# Altium schematic sheet Oscar_MainBoard_MCU.SchDoc
size A4
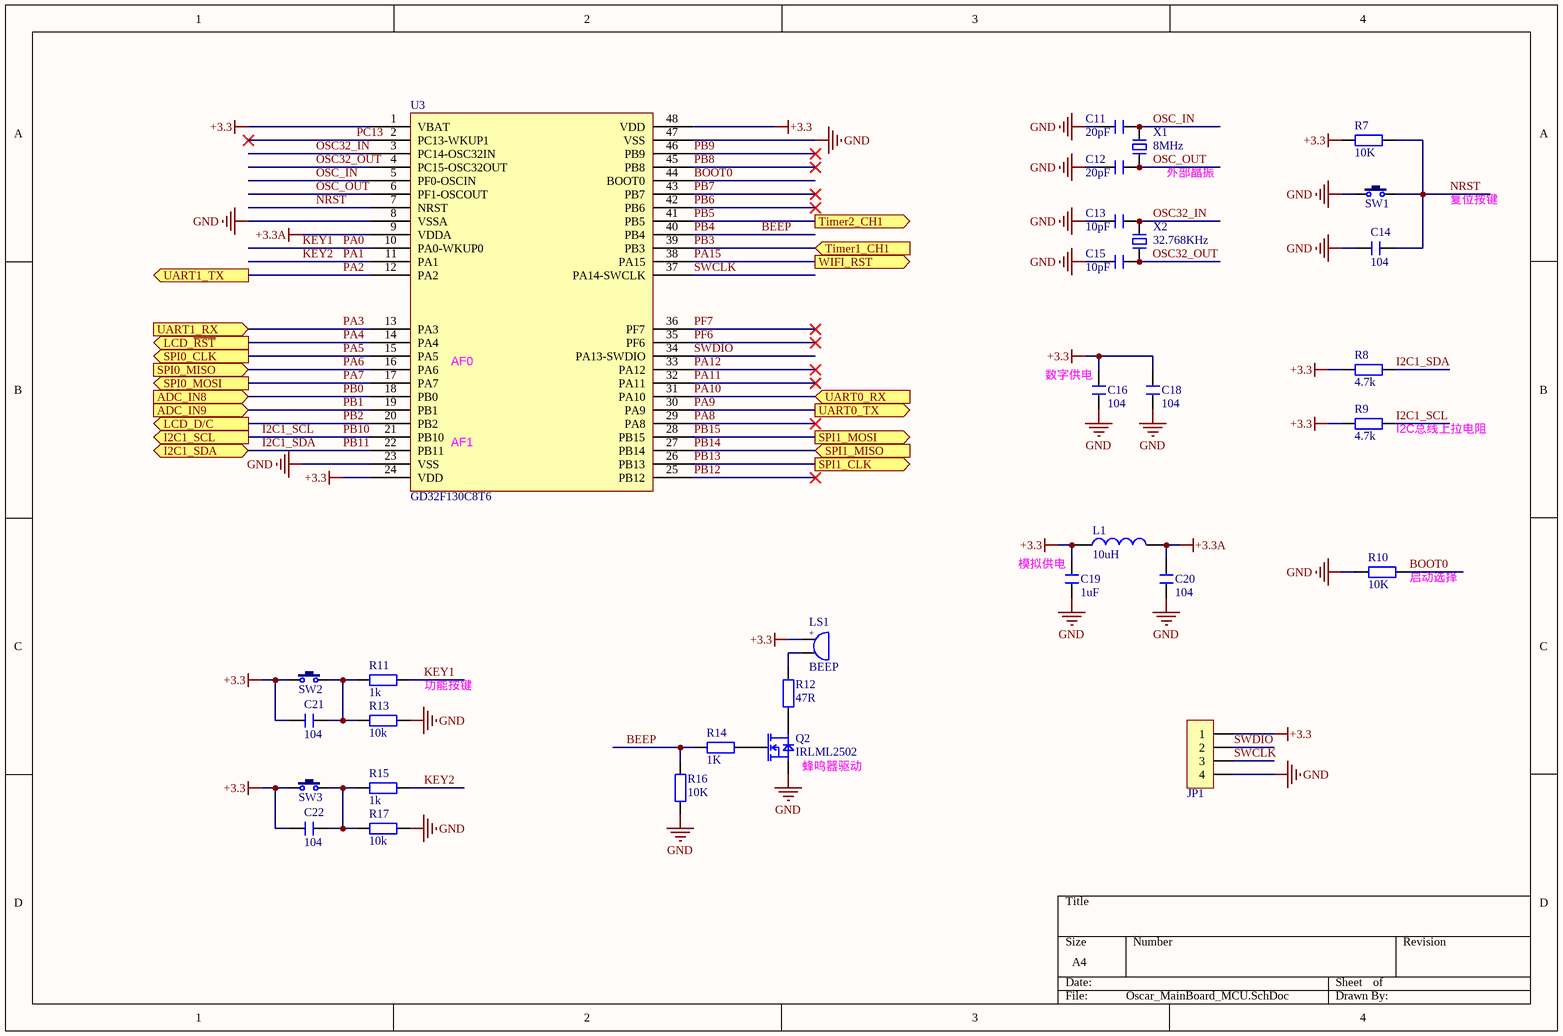
[diagram p0: Oscar_MainBoard_MCU.SchDoc]

## Parts
C11  20pF  [C 0402_L]
C12  20pF  [C 0402_L]
C13  10pF  [C 0402_L]
C14  104  [C 0402_L]
C15  10pF  [C 0402_L]
C16  104  [C 0402_L]
C18  104  [C 0402_L]
C19  1uF  [C 0402_L]
C20  104  [C 0402_L]
C21  104  [C 0402_L]
C22  104  [C 0402_L]
JP1  HDR-1X4  [HDR2.54-WS-4P]  (value not drawn)
L1  10uH  [L 0402]
LS1  BEEP  [BEEP 5020]
Q2  IRLML2502  [SOT23-3n]
R7  10K  [R 0402_L]
R8  4.7k  [R 0402_L]
R9  4.7k  [R 0402_L]
R10  10K  [R 0402_L]
R11  1k  [R 0402_L]
R12  47R  [R 0402_L]
R13  10k  [R 0402_L]
R14  1K  [R 0402_L]
R15  1k  [R 0402_L]
R16  10K  [R 0402_L]
R17  10k  [R 0402_L]
SW1  TSW  [龟仔 3*4]  (value not drawn)
SW2  TSW  [龟仔 3*4]  (value not drawn)
SW3  TSW  [龟仔 3*4]  (value not drawn)
U3  GD32F130C8T6  [LQFP48_N]
X1  8MHz  [NDK 3225]
X2  32.768KHz  [FC-135]

## Ports
ADC_IN8 (in), ADC_IN9 (in), I2C1_SCL (out), I2C1_SDA (bidir), LCD_D/C (out), LCD_~{RST} (out), SPI0_CLK (out), SPI0_MISO (in), SPI0_MOSI (out), SPI1_CLK (out), SPI1_MISO (in), SPI1_MOSI (out), Timer1_CH1 (in), Timer2_CH1 (out), UART0_RX (in), UART0_TX (out), UART1_RX (in), UART1_TX (out), WIFI_RST (out)

## Nets
+3.3: C16.2 C18.2 C19.2 C21.2 C22.2 JP1.1 L1.1 LS1.1 R7.2 R8.2 R9.2 SW2.1 SW3.1 U3.1(VBAT) U3.24(VDD) U3.48(VDD)
+3.3A: C20.2 L1.2 U3.9(VDDA)
GND: C11.1 C12.1 C13.1 C14.1 C15.1 C16.1 C18.1 C19.1 C20.1 JP1.4 Q2.2(S) R10.1 R13.1 R16.1 R17.1 SW1.1 U3.8(VSSA) U3.23(VSS) U3.47(VSS)
BEEP: R14.1 R16.2 U3.40(PB4)  [also labelled PB4]
BOOT0: R10.2 U3.44(BOOT0)
I2C1_SCL: R9.1 U3.21(PB10) ; port I2C1_SCL  [also labelled PB10]
I2C1_SDA: R8.1 U3.22(PB11) ; port I2C1_SDA  [also labelled PB11]
KEY1: R11.1 U3.10(PA0-WKUP0)  [also labelled PA0]
KEY2: R15.1 U3.11(PA1)  [also labelled PA1]
NRST: C14.2 R7.1 SW1.2 U3.7(NRST)
OSC32_IN: C13.2 U3.3(PC14-OSC32IN) X2.2
OSC32_OUT: C15.2 U3.4(PC15-OSC32OUT) X2.1
OSC_IN: C11.2 U3.5(PF0-OSCIN) X1.2
OSC_OUT: C12.2 U3.6(PF1-OSCOUT) X1.1
PA2: U3.12(PA2) ; port UART1_TX
PA3: U3.13(PA3) ; port UART1_RX
PA4: U3.14(PA4) ; port LCD_~{RST}
PA5: U3.15(PA5) ; port SPI0_CLK
PA6: U3.16(PA6) ; port SPI0_MISO
PA7: U3.17(PA7) ; port SPI0_MOSI
PA8: U3.29(PA8)
PA9: U3.30(PA9) ; port UART0_TX
PA10: U3.31(PA10) ; port UART0_RX
PA11: U3.32(PA11)
PA12: U3.33(PA12)
PA15: U3.38(PA15) ; port WIFI_RST
PB0: U3.18(PB0) ; port ADC_IN8
PB1: U3.19(PB1) ; port ADC_IN9
PB2: U3.20(PB2) ; port LCD_D/C
PB3: U3.39(PB3) ; port Timer1_CH1
PB5: U3.41(PB5) ; port Timer2_CH1
PB6: U3.42(PB6)
PB7: U3.43(PB7)
PB8: U3.45(PB8)
PB9: U3.46(PB9)
PB12: U3.25(PB12)
PB13: U3.26(PB13) ; port SPI1_CLK
PB14: U3.27(PB14) ; port SPI1_MISO
PB15: U3.28(PB15) ; port SPI1_MOSI
PC13: U3.2(PC13-WKUP1)
PF6: U3.35(PF6)
PF7: U3.36(PF7)
SWCLK: JP1.3 U3.37(PA14-SWCLK)
SWDIO: JP1.2 U3.34(PA13-SWDIO)
NetC21_1: C21.1 R11.2 R13.2 SW2.2
NetC22_1: C22.1 R15.2 R17.2 SW3.2
NetLS1_2: LS1.2 R12.2
NetQ2_1: Q2.1(G) R14.2
NetQ2_3: Q2.3(D) R12.1

## Notes on the sheet
- 外部晶振
- 复位按键
- (near U3) AF0
- (near C16) 数字供电
- (near U3) AF1
- (near R9) I2C总线上拉电阻
- (near C19) 模拟供电
- (near R10) 启动选择
- 功能按键
- (near Q2) 蜂鸣器驱动
- (in symbol BEEP) +

## Library data of the parts
C11-C16 C18-C22 = C: 贴片电容; BOM名称: 无极性贴片电容; 优秀评价可免费更新: 联系淘宝ID：黄晶宝石，获取更新版封装库; 卖家免费技术支持，联系售后: 唯一出售店铺网址https://shop463601444.taobao.com; 本封装库来自淘宝卖家 ID：黄晶宝石: 其他店铺购入均为盗版，请立即申请退款
JP1 = Header 4: 4P接插件; 版权归属: 封装库来自淘宝 ID：黄晶宝石; 优秀评价可免费更新: 联系淘宝ID：黄晶宝石，获取更新版封装库; 卖家免费技术支持，联系售后: 唯一出售店铺网址https://shop463601444.taobao.com; BOM名称: 4P接插件
L1 = L: 小功率贴片电感; 优秀评价可免费更新: 联系淘宝ID：黄晶宝石，获取更新版封装库; 卖家免费技术支持，联系售后: 唯一出售店铺网址https://shop463601444.taobao.com; 本封装库来自淘宝卖家 ID：黄晶宝石: 其他店铺购入均为盗版，请立即申请退款; BOM名称: 小功率贴片电感
LS1 = BEEP: 蜂鸣器; 优秀评价可免费更新: 联系淘宝ID：黄晶宝石，获取更新版封装库; 卖家免费技术支持，联系售后: 唯一出售店铺网址https://shop463601444.taobao.com; 封装库来自淘宝卖家 ID：黄晶宝石: 其他店铺购入均为盗版，请立即申请退款，本店提供现金奖励; BOM名称: 蜂鸣器
Q2 = IRLML2502: MOSFET N沟道 20V/4.2A
R7-R17 = R: 贴片电阻; 优秀评价可免费更新: 联系淘宝ID：黄晶宝石，获取更新版封装库; 卖家免费技术支持，联系售后: 唯一出售店铺网址https://shop463601444.taobao.com; 本封装库来自淘宝卖家 ID：黄晶宝石: 其他店铺购入均为盗版，请立即申请退款; BOM名称: 贴片电阻
SW1-SW3 = TSW: 轻触开关; BOM名称: 3x6轻触开关; 版权归属: 封装库来自淘宝 ID：黄晶宝石; 优秀评价可免费更新: 联系淘宝ID：黄晶宝石，获取更新版封装库; 卖家免费技术支持，联系售后: 唯一出售店铺网址https://shop463601444.taobao.com; 本封装库来自淘宝卖家 ID：黄晶宝石: 其他店铺购入均为盗版，请立即申请退款
U3 = GD32F130C8T6: 64K 8K 48MHz
X1 X2 = XTAL-2P: 2脚无源脚晶振; 版权归属: 封装库来自淘宝卖家 ID：黄晶宝石; 优秀评价可免费更新: 联系淘宝ID：黄晶宝石，获取更新版封装库; 卖家免费技术支持，联系售后: 唯一出售店铺网址https://shop463601444.taobao.com; 封装库来自淘宝卖家 ID：黄晶宝石: 其他店铺购入均为盗版，请立即申请退款; BOM名称: 2脚无源脚晶振